# EAGLE design 1593K-WirelessTallyReceiver-XBee (EAGLE 9.4.2)
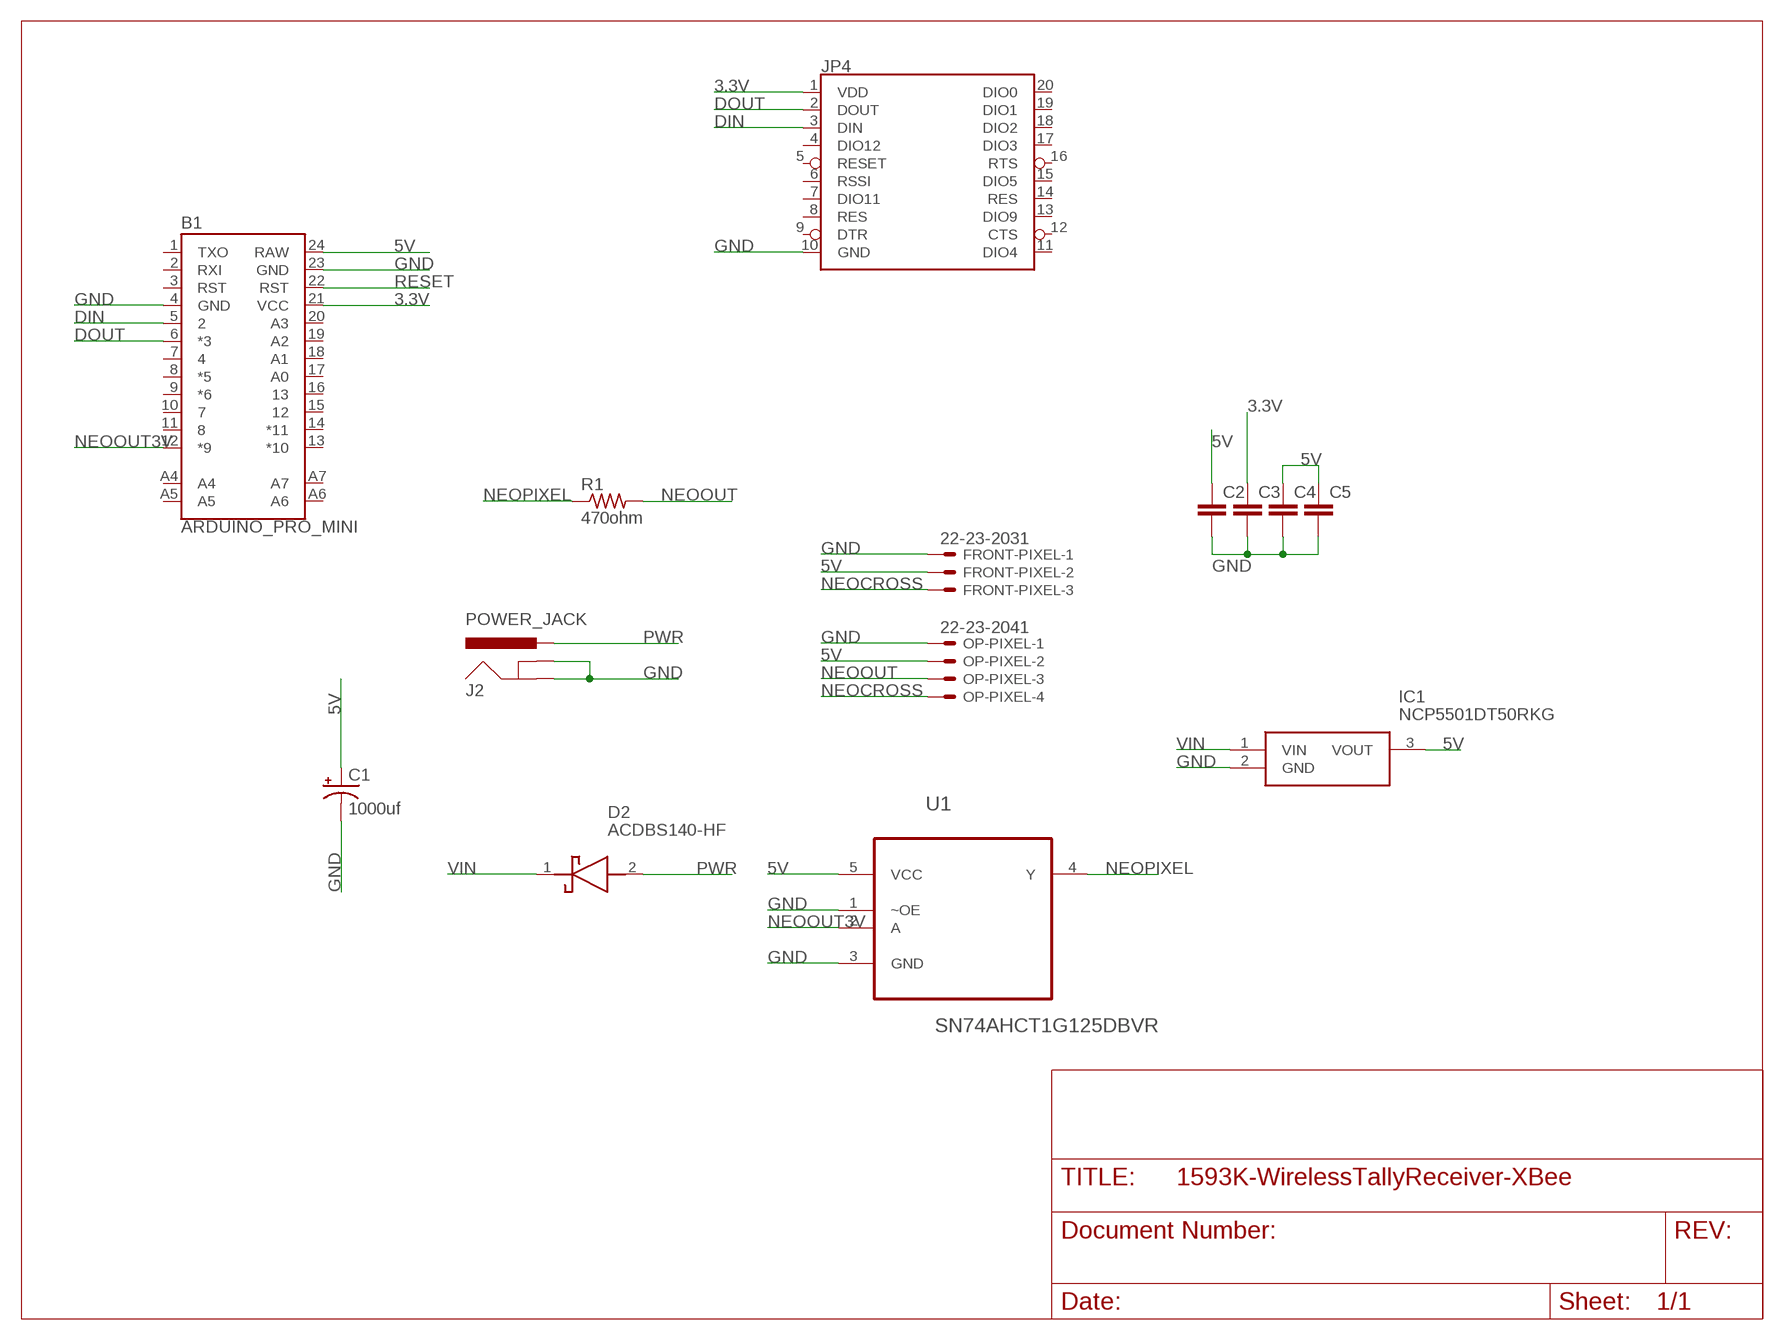
[diagram p0: schematic, sheet 1]

## Parts
B1  ARDUINO_PRO_MINI  [ARDUINO_PRO_MINI]
C1  1000uf  1000UF-RADIAL-5MM-25V-20%  [CPOL-RADIAL-5MM-10MM]
C2  CAPACITOR_0805_N  [RESC0805_N]
C3  CAPACITOR_0805_N  [RESC0805_N]
C4  CAPACITOR_0805_N  [RESC0805_N]
C5  CAPACITOR_0805_N  [RESC0805_N]
D2  ACDBS140-HF  [DIOM2013X100N]
FRONT-PIXEL  22-23-2031  [22-23-2031]
IC1  NCP5501DT50RKG  [NCP5501DT50RKG]
J2  POWER_JACK  [POWER_JACK_PTH]
JP4  XBEESILK  [XBEE-SILK]
OP-PIXEL  22-23-2041  [22-23-2041]
R1  470ohm  R-US_R0805  [R0805]
U1  SN74AHCT1G125DBVR  [SOT95P280X145-5N]

## Nets
3.3V: B1.21(VCC) C3.1 JP4.1(VDD)
5V: B1.24(RAW) C1.+ C2.1 C4.1 C5.1 FRONT-PIXEL.2 IC1.3(VOUT) OP-PIXEL.2 U1.5(VCC)
DIN: B1.5 JP4.3(DIN)
DOUT: B1.6(*3) JP4.2(DOUT)
GND: B1.4(GND) B1.23(GND) C1.- C2.2 C3.2 C4.2 C5.2 FRONT-PIXEL.1 IC1.2(GND) J2.GND J2.GNDBREAK JP4.10(GND) OP-PIXEL.1 U1.1(~OE) U1.3(GND)
NEOCROSS: FRONT-PIXEL.3 OP-PIXEL.4
NEOOUT: OP-PIXEL.3 R1.2
NEOOUT3V: B1.12(*9) U1.2(A)
NEOPIXEL: R1.1 U1.4(Y)
PWR: D2.2(A) J2.PWR
RESET: B1.22(RST)
VIN: D2.1(K) IC1.1(VIN)
Unconnected: B1.1(TXO) B1.2(RXI) B1.3(RST) B1.7 B1.8(*5) B1.9(*6) B1.10 B1.11 B1.13(*10) B1.14(*11) B1.15 B1.16 B1.17(A0) B1.18(A1) B1.19(A2) B1.20(A3) B1.A4 B1.A5 B1.A6 B1.A7 JP4.4(DIO12) JP4.5(RESET) JP4.6(RSSI) JP4.7(DIO11) JP4.8(RES) JP4.9(DTR) JP4.11(DIO4) JP4.12(CTS) JP4.13(DIO9) JP4.14(RES) JP4.15(DIO5) JP4.16(RTS) JP4.17(DIO3) JP4.18(DIO2) JP4.19(DIO1) JP4.20(DIO0)

## Library data of the parts
B1 = SparkFun-Boards:ARDUINO_PRO_MINI: SparkFun Pro Mini Pro Mini compatible footprint. Dimensions: 0.7 x 1.3" PCB Thickness: 0.8mm SparkFun Products: 3.3V/8MHz <https://www.sparkfun.com/products/11114> 5V/16MHz <https://www.sparkfun.com/products/11113>
C1 = SparkFun-Capacitors:1000UF: 1,000µF/1mF ceramic capacitors A capacitor is a passive two-terminal electrical component used to store electrical energy temporarily in an electric field. CAP-08070; PROD_ID: CAP-09538; VALUE: 1mF
C2-C5 = Nordic_nRF:CAPACITOR: Generic chip capacitor
D2 = SamacSys_Parts:ACDBS140-HF: Schottky Diodes & Rectifiers 40V 1A 0805 Source: Datasheet <https://componentsearchengine.com/Datasheets/1/ACDBS140-HF.pdf>; DESCRIPTION: Schottky Diodes & Rectifiers 40V 1A 0805; HEIGHT: 1mm; MANUFACTURER_NAME: Comchip Technology; MANUFACTURER_PART_NUMBER: ACDBS140-HF; MOUSER_PART_NUMBER: 750-ACDBS140-HF; MOUSER_PRICE-STOCK: https://www.mouser.com/Search/Refine.aspx?Keyword=750-ACDBS140-HF
FRONT-PIXEL = con-molex:22-23-2031: .100" (2.54mm) Center Header - 3 Pin; MF: MOLEX; MPN: 22-23-2031; OC_FARNELL: 1462950; OC_NEWARK: 30C0862
IC1 = SamacSys_Parts:NCP5501DT50RKG: ON SEMICONDUCTOR - NCP5501DT50RKG - LDO, FIXED, 5V, 0.5A, TO-252-3 Source: Datasheet <https://componentsearchengine.com/Datasheets/1/NCP5501DT50RKG.pdf>; DESCRIPTION: ON SEMICONDUCTOR - NCP5501DT50RKG - LDO, FIXED, 5V, 0.5A, TO-252-3; HEIGHT: 3mm; MANUFACTURER_NAME: ON Semiconductor; MANUFACTURER_PART_NUMBER: NCP5501DT50RKG; MOUSER_PART_NUMBER: 863-NCP5501DT50RKG; MOUSER_PRICE-STOCK: https://www.mouser.com/Search/Refine.aspx?Keyword=863-NCP5501DT50RKG
J2 = SparkFun-Connectors:POWER_JACK: Power Jack Connector This is the standard 5.5mm barrel jack for power. The PTH is the most common, proven, reliable, footprint. The Slot footprint only works if the mill layer is transmitted to the PCB fab house so be warned. Here are the connectors we sell at SparkFun: DC Barrel Power Jack/Connector <https://www.sparkfun.com/products/119> (PRT-00119) DC Barrel Power Jack/Connector (SMD) <https://www.sparkfun.com/products/12748> (PRT-12748) DC Barrel Jack Adapter - Breadboard Compatible <https://www.sparkfun.com/products/10811> (PRT-10811) It is used on this SparkFun product (and many, many others): SparkFun RedBoard - Programmed with Arduino <https://www.sparkfun.com/products/12757> (DEV-12757) Also, if you need a mating power supply or connector, please check these out: Wall Adapter Power Supply - 9VDC 650mA <https://www.sparkfun.com/products/298> (TOL-00298) DC Barrel Jack Adapter - Male <https://www.sparkfun.com/products/10287> (PRT-10287); PROD_ID: CONN-08197
JP4 = SparkFun-RF:XBEE: Digi XBee and XBee Pro XBees are tiny blue chips that can communicate wirelessly with each other. They can do simple things, like replacing a couple of wires in serial communication, which is nice when you want to make a remote for your paintball vehicle. SparkFun Products SparkFun XBee Buying Guide <https://www.sparkfun.com/pages/xbee_guide> SparkFun XBee Explorer USB <https://www.sparkfun.com/products/11812> (WRL-11812) Breakout Board for XBee Module <https://www.sparkfun.com/products/8276> (WRL-8276) SparkFun XBee Explorer Regulated <https://www.sparkfun.com/products/11373> (WRL-11373) SparkFun XBee Explorer Dongle <https://www.sparkfun.com/products/11697> (WRL-11697) SparkFun XBee Shield <https://www.sparkfun.com/products/12847> (WRL-12847) SparkFun XBee Explorer Serial <https://www.sparkfun.com/products/13225> (WRL-13225)
OP-PIXEL = con-molex:22-23-2041: .100" (2.54mm) Center Header - 4 Pin; MF: MOLEX; MPN: 22-23-2041; OC_FARNELL: 1462920; OC_NEWARK: 38C0355
R1 = rcl:R-US_: RESISTOR, American symbol; SPICEPREFIX: R
U1 = Texas Instruments_By_element14_Batch_1:SN74AHCT1G125DBVR: Single Bus Buffer Gate with 3-State Output; MPN: SN74AHCT1G125DBVR; OC_FARNELL: 1105927; OC_NEWARK: 74C6908; PACKAGE: SOT-23-5; SUPPLIER: Texas Instruments

## Board
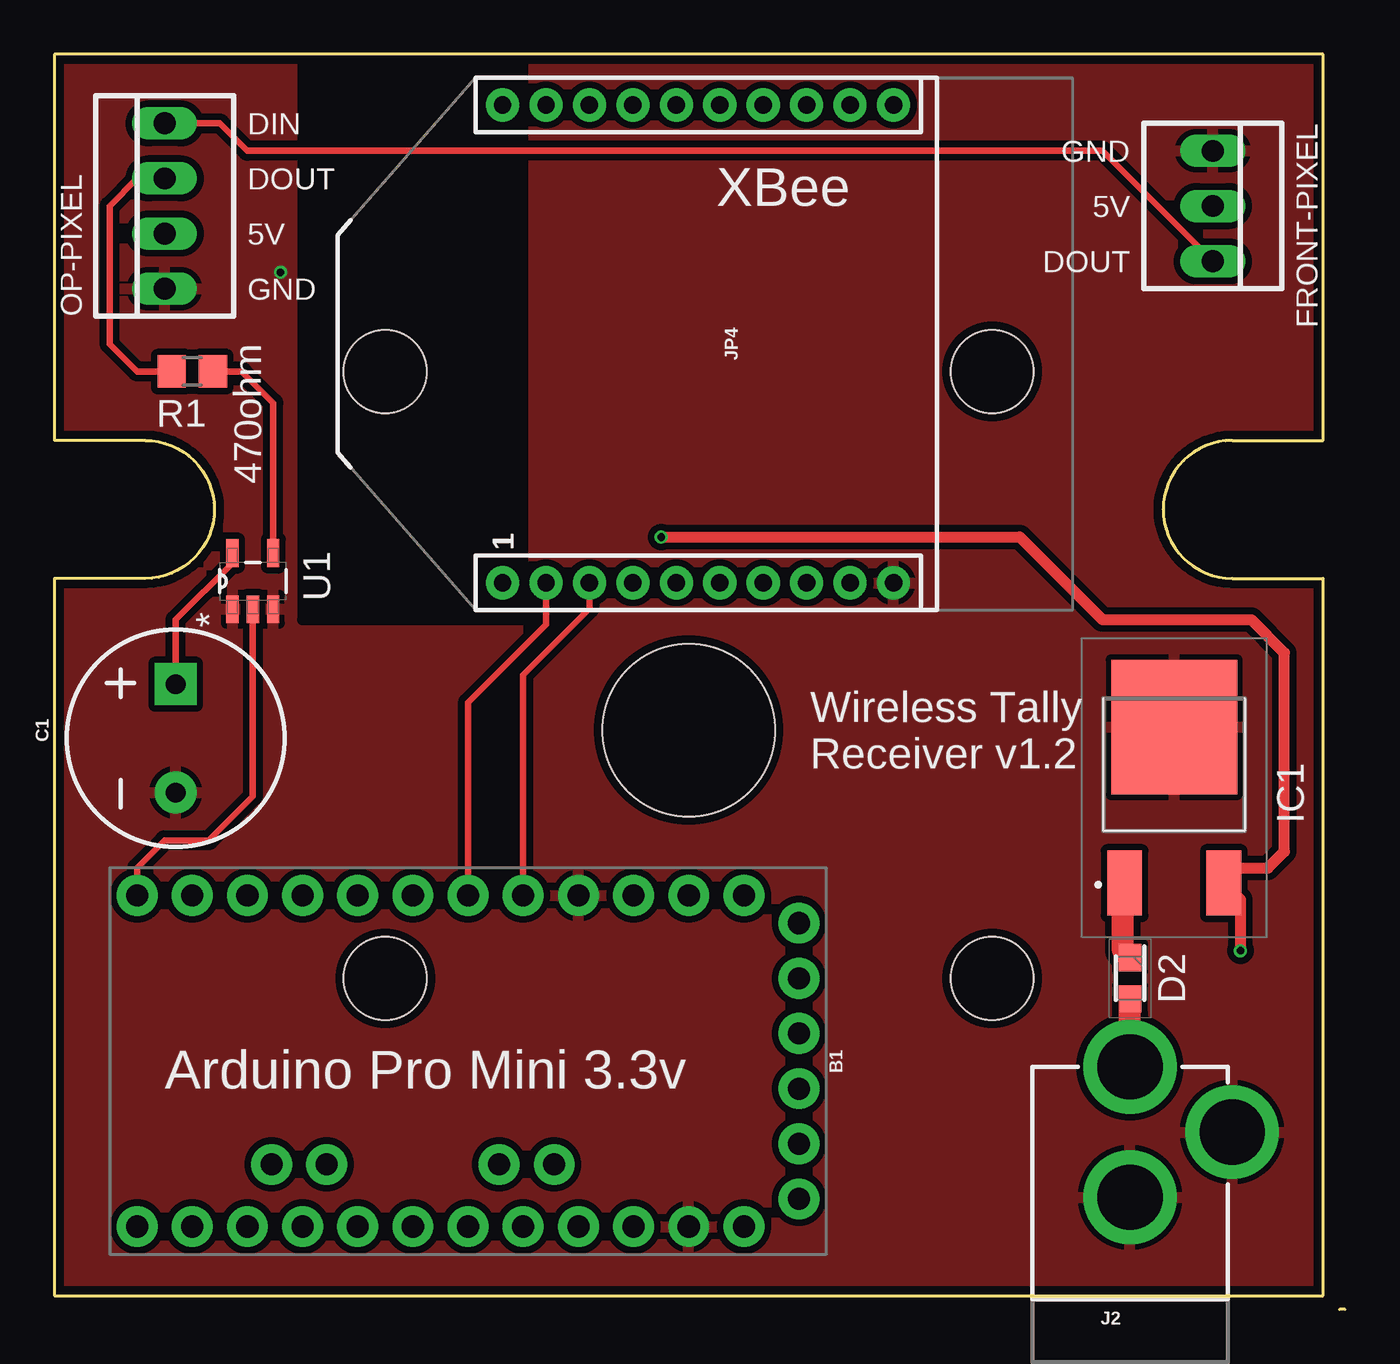
[diagram p1: board, top side]
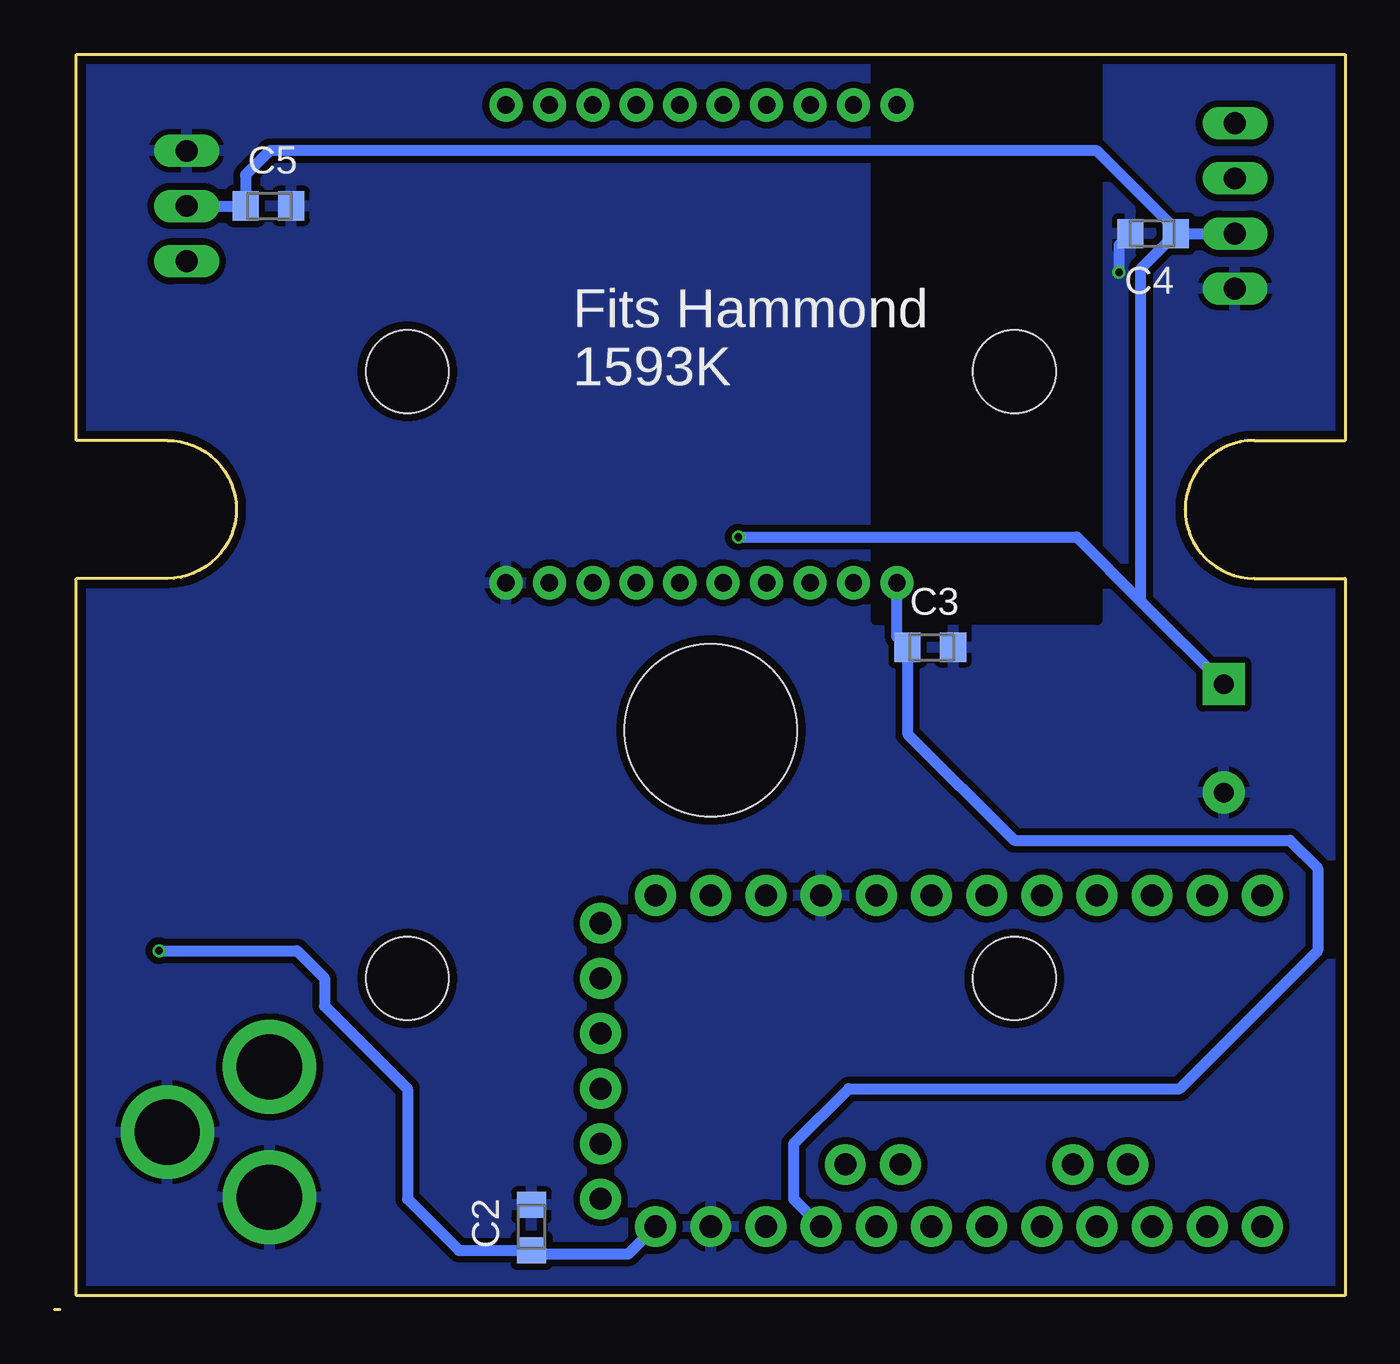
[diagram p2: board, bottom side, seen from below]

Size 59.44 x 57.78 mm. Coordinates in mm from the lower left corner, seen from the top.
Copper layers (1*16): Top 0.035559375mm / dielectric 1.6mm / Bottom 0.035559375mm
Design rules "default": minimum track width 6mil, minimum drill 10mil, track to track 6mil, track to pad 6mil, pad to pad 6mil, via to via 6mil, smd to smd 6mil, copper to edge 15mil, drill to drill 6mil, minimum pad ring 5mil, minimum via ring 5mil, stop-mask expansion 2.5mil, vias tented up to drill 0mil, thermal gap 10mil
Holes 7.94 mm at 29.21,26.67

### Footprints (pad centres in the part's own frame; a part is rotated, then mirrored left to right if it is on the bottom)
ARDUINO_PRO_MINI = drill 1.016 pad 1.88: 1 -7.62,12.7; 2 -7.62,10.16; 3 -7.62,7.62; 4 -7.62,5.08; 5 -7.62,2.54; 6 -7.62,0; 7 -7.62,-2.54; 8 -7.62,-5.08; 9 -7.62,-7.62; 10 -7.62,-10.16; 11 -7.62,-12.7; 12 -7.62,-15.24; 13 7.62,-15.24; 14 7.62,-12.7; 15 7.62,-10.16; 16 7.62,-7.62; 17 7.62,-5.08; 18 7.62,-2.54; 19 7.62,0; 20 7.62,2.54; 21 7.62,5.08; 22 7.62,7.62; 23 7.62,10.16; 24 7.62,12.7; A4 4.763,1.429; A5 4.763,3.969; A6 4.763,-9.049; A7 4.763,-6.509; BLK -6.35,15.24; GND -3.81,15.24; GRN 6.35,15.24; RXI 1.27,15.24; TXO 3.81,15.24; VCC -1.27,15.24
CPOL-RADIAL-5MM-10MM = drill 0.9 pad 1.93 square: + 2.5,0 | drill 0.9 pad 1.93: - -2.5,0
RESC0805_N = smd 1.2 x 1.35: 1 -1.1,0; 2 1,0
DIOM2013X100N = smd 1.25 x 1.05: 1 -0.95,0; 2 0.95,0
22-23-2031 = drill 1 long: 1 -2.54,0; 2 0,0; 3 2.54,0
NCP5501DT50RKG = smd 3 x 1.6: 1 4.25,-2.285; 3 4.25,2.285 | smd 6.2 x 5.8: 2 -2.93,0
POWER_JACK_PTH = drill 2.997 pad 4.318: GND 0,7.7; GNDBREAK 4.7,10.7; PWR 0,13.7
XBEE-SILK = drill 0.8 pad 1.524: 1 -11,20; 2 -11,18; 3 -11,16; 4 -11,14; 5 -11,12; 6 -11,10; 7 -11,8; 8 -11,6; 9 -11,4; 10 -11,2; 11 11,2; 12 11,4; 13 11,6; 14 11,8; 15 11,10; 16 11,12; 17 11,14; 18 11,16; 19 11,18; 20 11,20
22-23-2041 = drill 1 long: 1 -3.81,0; 2 -1.27,0; 3 1.27,0; 4 3.81,0
R0805 = smd 1.3 x 1.5: 1 -0.95,0; 2 0.95,0
SOT95P280X145-5N = smd 1.27 x 0.559: 1 -1.295,0.94; 2 -1.295,0; 3 -1.295,-0.94; 4 1.295,-0.94; 5 1.295,0.94
1593K = hole 3.81: -13.97,-13.97; -13.97,13.97; 13.97,13.97; 13.97,-13.97

### Placement (x,y rotation side)
B1  19.05,11.43 270 top
C1  5.59,26.29 90 top
C2  37.47,3.81 90 bottom
C3  19.05,30.48 0 bottom
C4  8.89,49.53 180 bottom
C5  49.53,50.8 0 bottom
D2  49.53,15.24 270 top
FRONT-PIXEL  53.34,50.8 270 top
IC1  51.56,23.88 270 top
J2  49.53,-2.54 0 top
JP4  40.64,44.45 90 top
OP-PIXEL  5.08,50.8 90 top
R1  6.35,43.18 180 top
U1  9.14,33.53 90 top
U$1  [1593K]  29.21,29.21 0 top

### Tracks (layer width: path | path; a pad name or v marks a point on that pad's centre or on a via)
3.3V
  Bottom 0.508: B1.21 25.4,5.08 25.4,7.62 22.86,10.16 7.62,10.16 1.27,16.51 1.27,20.32 2.54,21.59 15.24,21.59 20.15,26.5 C3.1 20.64,30.97 JP4.1
5V  (via drill 0.35)
  Top 0.305: C1.+ 5.59,31.75 8.2,34.37 U1.5
  Top 0.508: v27.94,35.56 44.45,35.56 48.26,31.75 55.12,31.75 56.64,30.23 56.64,21.08 55.88,20.32 54.54,20.32 IC1.3 54.61,18.86 v54.61,16.51
  Bottom 0.508: 9.4,32.6 C1.+ | 9.4,32.6 12.36,35.56 v27.94,35.56 | FRONT-PIXEL.2 C5.1 50.63,52.24 49.53,53.34 11.43,53.34 7.79,49.7 C4.1 | C4.1 9.4,47.92 9.4,32.6 | C4.1 OP-PIXEL.2 | B1.24 33.02,2.54 37.3,2.54 C2.1 40.81,2.71 43.18,5.08 43.18,10.16 46.99,13.97 46.99,15.24 48.26,16.51 v54.61,16.51
DIN
  Top 0.305: JP4.3 24.64,32.26 21.59,29.21 B1.5
DOUT
  Top 0.305: B1.6 19.05,27.94 22.64,31.53 JP4.2
GND  (via drill 0.35)
  Bottom 0.508: C4.2 10.41,49.01 v10.41,47.75
  pour Top (isolate 0.305): -1.27,0 -1.27,58.42 59.69,58.42 59.69,0
  pour Bottom (isolate 0.305): -1.27,0 -1.27,58.42 59.69,58.42 59.69,6.35 62.23,3.81 62.23,0
N$1
  cutout Bottom (isolate 0.305): 11.43,58.42 11.43,31.75 21.59,31.75 21.59,58.42
N$2
  cutout Top (isolate 0.305): 11.43,58.42 11.43,31.75 21.59,31.75 21.59,58.42
NEOCROSS
  Top 0.305: OP-PIXEL.4 7.62,54.61 8.89,53.34 48.26,53.34 FRONT-PIXEL.3
NEOOUT
  Top 0.305: R1.2 3.81,43.18 2.54,44.45 2.54,50.8 3.81,52.07 OP-PIXEL.3
NEOOUT3V
  Top 0.305: B1.12 3.81,20.32 5.08,21.59 7.11,21.59 9.14,23.62 U1.2
NEOPIXEL
  Top 0.305: U1.4 10.08,41.73 8.64,43.18 R1.1
PWR
  Top 1.016: J2.PWR D2.2
VIN
  Top 0.508: 49.21,19.56 IC1.1
  Top 1.016: D2.1 49.21,16.51 49.21,19.56

### Text on the board
tNames: DIN | GND | DOUT | XBee | 5V | 5V | DOUT | GND | Wireless Tally / Receiver v1.2 | Arduino Pro Mini 3.3v
bNames: Fits Hammond / 1593K